# Altium schematic sheet Blackbox_BauhallenUhr_Schematic.SchDoc
size A4; DocumentNumber: 1; SheetNumber: 1; SheetTotal: 6
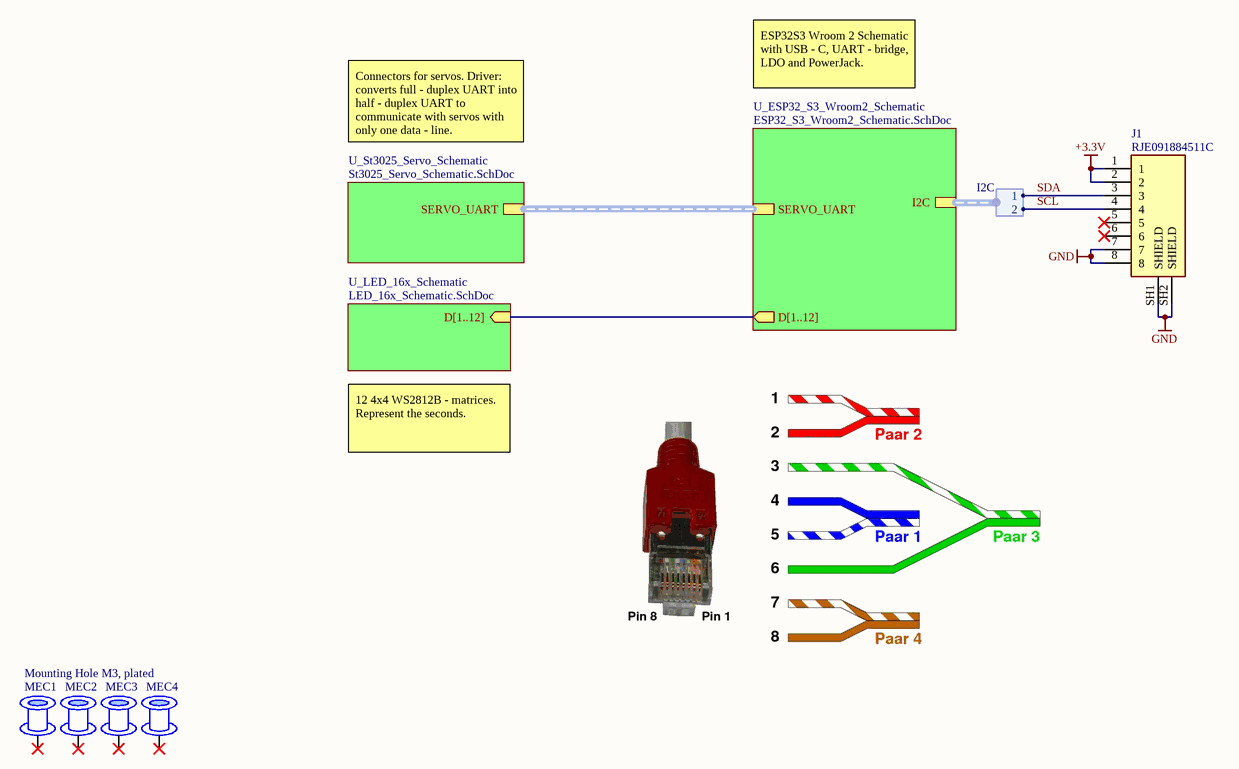
[diagram p0: Blackbox_BauhallenUhr_Schematic.SchDoc]

## Parts
J1  RJE091884511C  [RJ45]
MEC1  Mounting Hole M3, plated  [Mounting Hole M3, plated]
MEC2  Mounting Hole M3, plated  [Mounting Hole M3, plated]  (value not drawn)
MEC3  Mounting Hole M3, plated  [Mounting Hole M3, plated]  (value not drawn)
MEC4  Mounting Hole M3, plated  [Mounting Hole M3, plated]  (value not drawn)

## Sub-sheets
U_ESP32_S3_Wroom2_Schematic = ESP32_S3_Wroom2_Schematic.SchDoc: D[1..12] (out), I2C (harness I2C), SERVO_UART (harness SERVO_UART)
U_LED_16x_Schematic = LED_16x_Schematic.SchDoc: D[1..12] (in)
U_St3025_Servo_Schematic = St3025_Servo_Schematic.SchDoc: SERVO_UART (harness SERVO_UART)

## Harnesses
I2C: 1, 2

## Nets
+3.3V: J1.1 J1.2
GND: J1.7 J1.8 J1.SH1(SHIELD) J1.SH2(SHIELD)
SCL: J1.4 ; sheet U_ESP32_S3_Wroom2_Schematic/I2C.2
SDA: J1.3 ; sheet U_ESP32_S3_Wroom2_Schematic/I2C.1

Not connected (* = marked no-connect by the designer): J1 5* 6*; MEC1 1*; MEC2 1*; MEC3 1*; MEC4 1*

## Buses and harness runs
bus sheet U_ESP32_S3_Wroom2_Schematic/D[1..12] = sheet U_LED_16x_Schematic/D[1..12]
harness sheet U_ESP32_S3_Wroom2_Schematic/SERVO_UART = sheet U_St3025_Servo_Schematic/SERVO_UART

## Notes on the sheet
- ESP32S3 Wroom 2 Schematic with USB - C, UART - bridge, LDO and PowerJack.
- Connectors for servos. Driver: converts full - duplex UART into half - duplex UART to communicate with servos with only one data - line.
- 12 4x4 WS2812B - matrices. Represent the seconds.
- Date:
- Title of drawing:
- Time:
- Drawn by:
- Project:
- Revision:
- Institut:
- Departement:
- Page:
- from:
- File:

## Library data of the parts
J1 = RJ45: Jack Modular Connector 8p8c (RJ45, Ethernet) 90Â° Angle (Right) Shielded Cat3.; MF: Amphenol ICC (Commercial Products); SnapEDA_Link: https://www.snapeda.com/parts/RJE091884511C/Amphenol/view-part/?ref=snap; Package: None; System: Connector; MP: RJE091884511C; Check_prices: https://www.snapeda.com/parts/RJE091884511C/Amphenol/view-part/?ref=eda; Parameter 1: *
MEC1-MEC4 = Mounting Hole M3, plated: Mounting Hole for M3 Screw, plated to connect signal